# Altium schematic sheet Connections.SchDoc
size A4; SheetNumber: 1; SheetTotal: 4
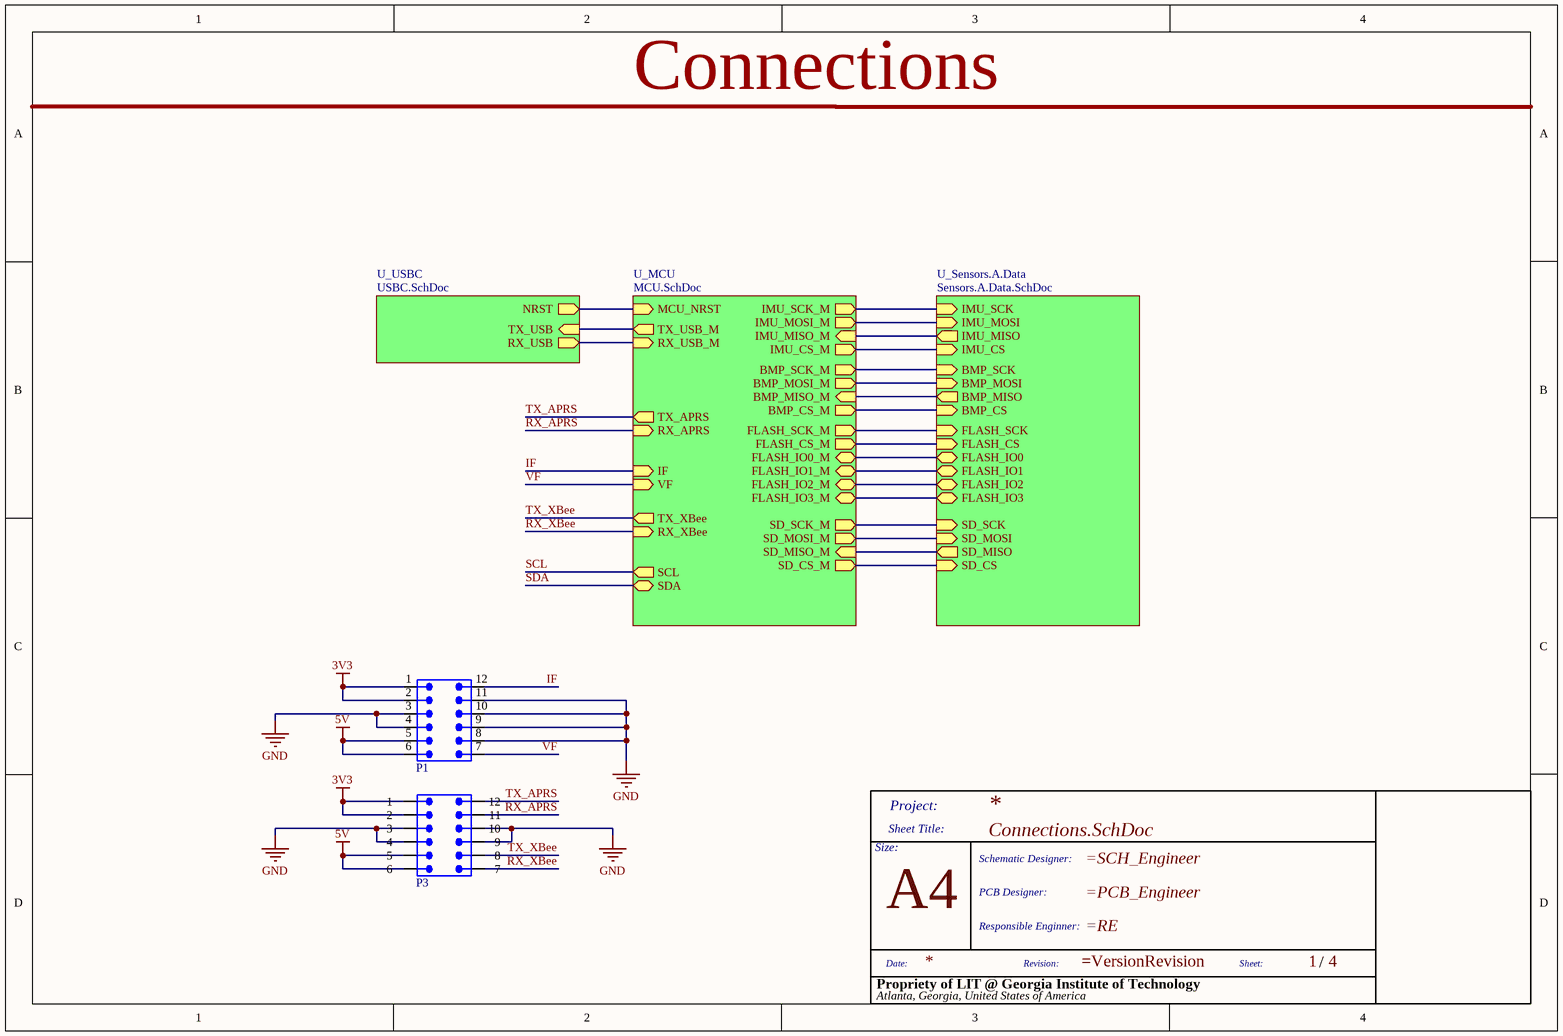
[diagram p0: Connections.SchDoc]

## Parts
*  Size: A4  (hidden comment: TitleBlock)  (graphical)
P1  HTST-106-01-L-DV-P-TR  [HTST-106-01-L-DV-P-TR]  (value not drawn)
P3  NPPC062KFMS-RC  [NPPC062KFMS-RC]  (value not drawn)

## Sub-sheets
U_MCU = MCU.SchDoc: MCU_NRST (in), IF (in), VF (in), SD_MOSI_M (out), SD_MISO_M (in), SD_SCK_M (out), SD_CS_M (out), TX_APRS (out), RX_APRS (in), RX_XBee (in), TX_XBee (out), BMP_SCK_M (out), BMP_MISO_M (in), BMP_MOSI_M (out), BMP_CS_M (out), SCL (out), SDA (bidir), IMU_SCK_M (out), IMU_MISO_M (in), IMU_MOSI_M (out), IMU_CS_M (out), TX_USB_M (out), RX_USB_M (in), FLASH_IO3_M (bidir), FLASH_IO2_M (bidir), FLASH_IO1_M (bidir), FLASH_IO0_M (bidir), FLASH_SCK_M (out), FLASH_CS_M (out)
U_Sensors.A.Data = Sensors.A.Data.SchDoc: IMU_SCK (in), IMU_MOSI (in), IMU_MISO (out), IMU_CS (in), BMP_SCK (in), BMP_MOSI (in), BMP_MISO (out), BMP_CS (in), SD_CS (in), SD_MOSI (in), SD_SCK (in), SD_MISO (out), FLASH_CS (in), FLASH_SCK (in), FLASH_IO3 (bidir), FLASH_IO0 (bidir), FLASH_IO1 (bidir), FLASH_IO2 (bidir)
U_USBC = USBC.SchDoc: NRST (out), TX_USB (in), RX_USB (out)

## Nets
3V3: P1.1 P1.2 P3.11(2) P3.12(1)
5V: P1.5 P1.6 P3.7(6) P3.8(5)
GND: P1.3 P1.4 P1.8 P1.9 P1.10 P1.11 P3.3(10) P3.4(9) P3.9(4) P3.10(3)
IF: P1.12 ; sheet U_MCU/IF
RX_APRS: P3.2(11) ; sheet U_MCU/RX_APRS
RX_XBee: P3.6(7) ; sheet U_MCU/RX_XBee
SCL: sheet U_MCU/SCL
SDA: sheet U_MCU/SDA
TX_APRS: P3.1(12) ; sheet U_MCU/TX_APRS
TX_XBee: P3.5(8) ; sheet U_MCU/TX_XBee
VF: P1.7 ; sheet U_MCU/VF
(unnamed): sheet U_Sensors.A.Data/IMU_SCK, sheet U_MCU/IMU_SCK_M
(unnamed): sheet U_Sensors.A.Data/IMU_MOSI, sheet U_MCU/IMU_MOSI_M
(unnamed): sheet U_Sensors.A.Data/IMU_MISO, sheet U_MCU/IMU_MISO_M
(unnamed): sheet U_Sensors.A.Data/IMU_CS, sheet U_MCU/IMU_CS_M
(unnamed): sheet U_Sensors.A.Data/BMP_SCK, sheet U_MCU/BMP_SCK_M
(unnamed): sheet U_Sensors.A.Data/BMP_MOSI, sheet U_MCU/BMP_MOSI_M
(unnamed): sheet U_Sensors.A.Data/BMP_MISO, sheet U_MCU/BMP_MISO_M
(unnamed): sheet U_Sensors.A.Data/BMP_CS, sheet U_MCU/BMP_CS_M
(unnamed): sheet U_Sensors.A.Data/SD_CS, sheet U_MCU/SD_CS_M
(unnamed): sheet U_Sensors.A.Data/SD_MOSI, sheet U_MCU/SD_MOSI_M
(unnamed): sheet U_Sensors.A.Data/SD_SCK, sheet U_MCU/SD_SCK_M
(unnamed): sheet U_Sensors.A.Data/SD_MISO, sheet U_MCU/SD_MISO_M
(unnamed): sheet U_Sensors.A.Data/FLASH_CS, sheet U_MCU/FLASH_CS_M
(unnamed): sheet U_Sensors.A.Data/FLASH_SCK, sheet U_MCU/FLASH_SCK_M
(unnamed): sheet U_Sensors.A.Data/FLASH_IO3, sheet U_MCU/FLASH_IO3_M
(unnamed): sheet U_Sensors.A.Data/FLASH_IO0, sheet U_MCU/FLASH_IO0_M
(unnamed): sheet U_Sensors.A.Data/FLASH_IO1, sheet U_MCU/FLASH_IO1_M
(unnamed): sheet U_Sensors.A.Data/FLASH_IO2, sheet U_MCU/FLASH_IO2_M
(unnamed): sheet U_USBC/NRST, sheet U_MCU/MCU_NRST
(unnamed): sheet U_USBC/TX_USB, sheet U_MCU/TX_USB_M
(unnamed): sheet U_USBC/RX_USB, sheet U_MCU/RX_USB_M

## Notes on the sheet
- Connections
- (in symbol TitleBlock) Project:; Sheet Title:; Size:; Schematic Designer:; PCB Designer:; Responsible Enginner:; Date:; Revision:; Sheet:; /; Propriety of LIT @ Georgia Institute of Technology; Atlanta, Georgia, United States of America

## Library data of the parts
* = TitleBlock: Standard Title Block
P1 = BoardToBoard_Bottom: Connector Header Through Hole 12 position 0.100" (2.54mm)
P3 = BoardToBoard_Top: 12 Position Receptacle Connector 0.100" (2.54mm) Through Hole Gold